# Altium project CAN_PDM.PrjPcb (part 2 of 2)

## Sheet LED_STATUS_OUTPUTS.SchDoc
size A4; SheetNumber: 12; SheetTotal: 14
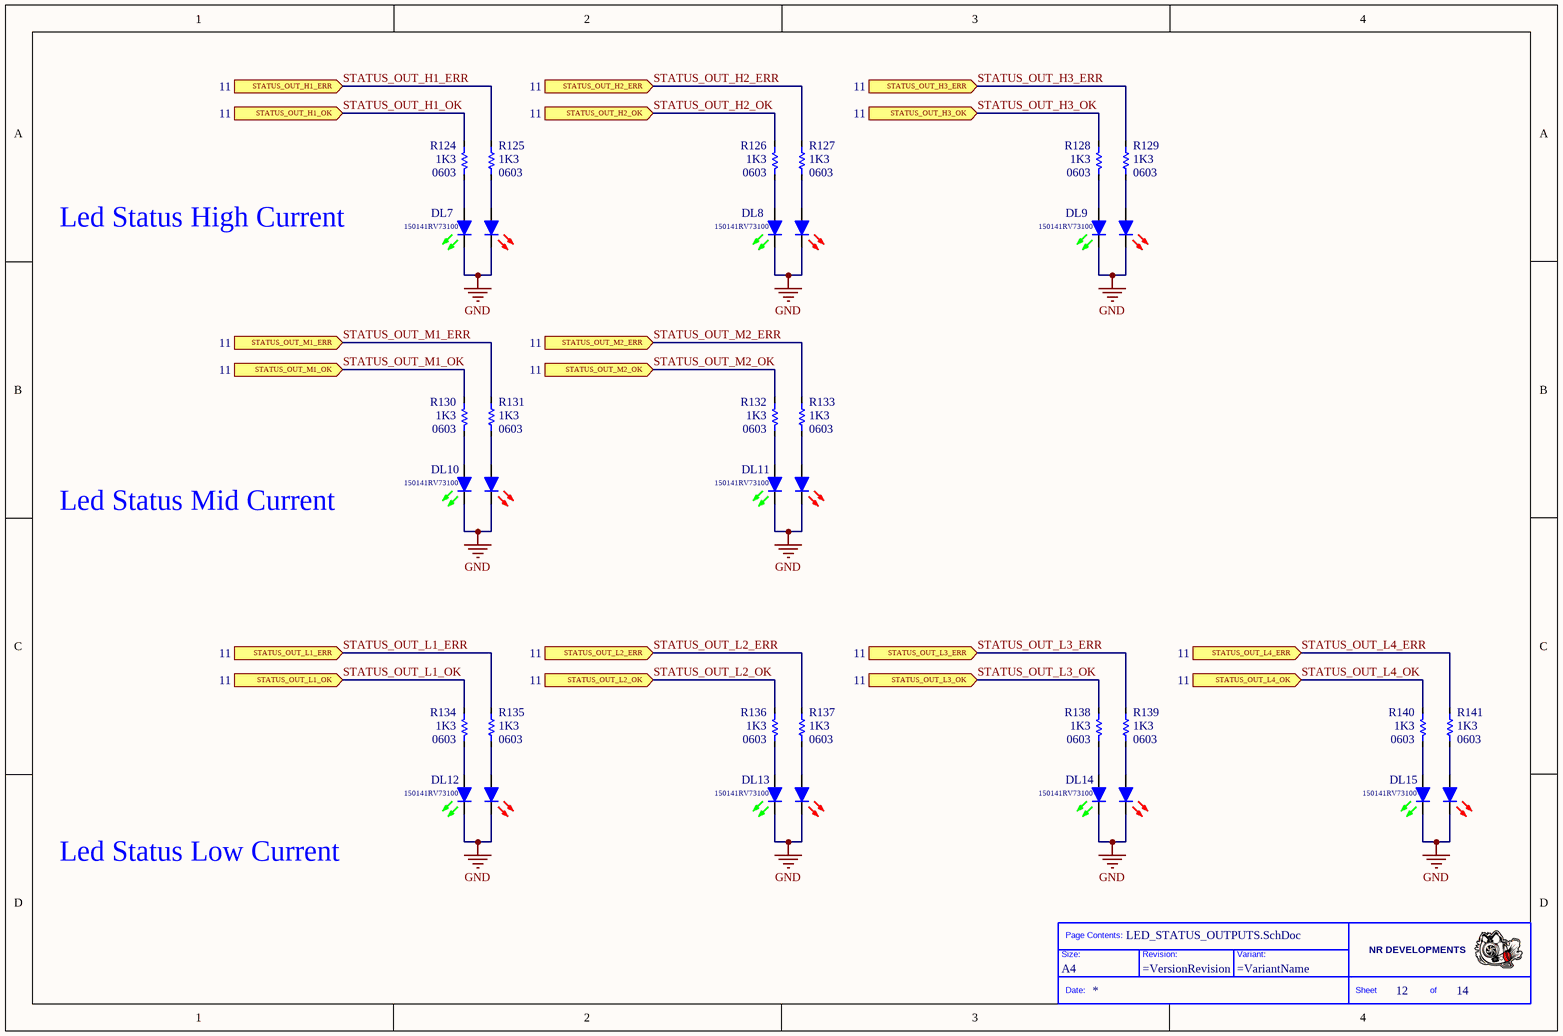
[diagram p11: LED_STATUS_OUTPUTS.SchDoc]

### Parts
(Parts that share a designator on the sheet are numbered #1, #2 ... from top to bottom, then left to right.)
*#10  Size: A4  (hidden comment: Title_Block)  (graphical)
DL7  value 150141RV73100  [WURTH-SBTW_3528]  (hidden comment: LED_Red_Green)
DL8  value 150141RV73100  [WURTH-SBTW_3528]  (hidden comment: LED_Red_Green)
DL9  value 150141RV73100  [WURTH-SBTW_3528]  (hidden comment: LED_Red_Green)
DL10  value 150141RV73100  [WURTH-SBTW_3528]  (hidden comment: LED_Red_Green)
DL11  value 150141RV73100  [WURTH-SBTW_3528]  (hidden comment: LED_Red_Green)
DL12  value 150141RV73100  [WURTH-SBTW_3528]  (hidden comment: LED_Red_Green)
DL13  value 150141RV73100  [WURTH-SBTW_3528]  (hidden comment: LED_Red_Green)
DL14  value 150141RV73100  [WURTH-SBTW_3528]  (hidden comment: LED_Red_Green)
DL15  value 150141RV73100  [WURTH-SBTW_3528]  (hidden comment: LED_Red_Green)
R124  value 1K3  Case: 0603  [RESC1608X06M]  (hidden comment: Res)
R125  value 1K3  Case: 0603  [RESC1608X06M]  (hidden comment: Res)
R126  value 1K3  Case: 0603  [RESC1608X06M]  (hidden comment: Res)
R127  value 1K3  Case: 0603  [RESC1608X06M]  (hidden comment: Res)
R128  value 1K3  Case: 0603  [RESC1608X06M]  (hidden comment: Res)
R129  value 1K3  Case: 0603  [RESC1608X06M]  (hidden comment: Res)
R130  value 1K3  Case: 0603  [RESC1608X06M]  (hidden comment: Res)
R131  value 1K3  Case: 0603  [RESC1608X06M]  (hidden comment: Res)
R132  value 1K3  Case: 0603  [RESC1608X06M]  (hidden comment: Res)
R133  value 1K3  Case: 0603  [RESC1608X06M]  (hidden comment: Res)
R134  value 1K3  Case: 0603  [RESC1608X06M]  (hidden comment: Res)
R135  value 1K3  Case: 0603  [RESC1608X06M]  (hidden comment: Res)
R136  value 1K3  Case: 0603  [RESC1608X06M]  (hidden comment: Res)
R137  value 1K3  Case: 0603  [RESC1608X06M]  (hidden comment: Res)
R138  value 1K3  Case: 0603  [RESC1608X06M]  (hidden comment: Res)
R139  value 1K3  Case: 0603  [RESC1608X06M]  (hidden comment: Res)
R140  value 1K3  Case: 0603  [RESC1608X06M]  (hidden comment: Res)
R141  value 1K3  Case: 0603  [RESC1608X06M]  (hidden comment: Res)

### Ports
STATUS_OUT_H1_ERR (in, see 11), STATUS_OUT_H1_OK (in, see 11), STATUS_OUT_H2_ERR (in, see 11), STATUS_OUT_H2_OK (in, see 11), STATUS_OUT_H3_ERR (in, see 11), STATUS_OUT_H3_OK (in, see 11), STATUS_OUT_L1_ERR (in, see 11), STATUS_OUT_L1_OK (in, see 11), STATUS_OUT_L2_ERR (in, see 11), STATUS_OUT_L2_OK (in, see 11), STATUS_OUT_L3_ERR (in, see 11), STATUS_OUT_L3_OK (in, see 11), STATUS_OUT_L4_ERR (in, see 11), STATUS_OUT_L4_OK (in, see 11), STATUS_OUT_M1_ERR (in, see 11), STATUS_OUT_M1_OK (in, see 11), STATUS_OUT_M2_ERR (in, see 11), STATUS_OUT_M2_OK (in, see 11)

### Nets
GND: DL7.C1 DL7.C2 DL8.C1 DL8.C2 DL9.C1 DL9.C2 DL10.C1 DL10.C2 DL11.C1 DL11.C2 DL12.C1 DL12.C2 DL13.C1 DL13.C2 DL14.C1 DL14.C2 DL15.C1 DL15.C2
STATUS_OUT_H1_ERR: R125.2 ; port STATUS_OUT_H1_ERR
STATUS_OUT_H1_OK: R124.2 ; port STATUS_OUT_H1_OK
STATUS_OUT_H2_ERR: R127.2 ; port STATUS_OUT_H2_ERR
STATUS_OUT_H2_OK: R126.2 ; port STATUS_OUT_H2_OK
STATUS_OUT_H3_ERR: R129.2 ; port STATUS_OUT_H3_ERR
STATUS_OUT_H3_OK: R128.2 ; port STATUS_OUT_H3_OK
STATUS_OUT_L1_ERR: R135.2 ; port STATUS_OUT_L1_ERR
STATUS_OUT_L1_OK: R134.2 ; port STATUS_OUT_L1_OK
STATUS_OUT_L2_ERR: R137.2 ; port STATUS_OUT_L2_ERR
STATUS_OUT_L2_OK: R136.2 ; port STATUS_OUT_L2_OK
STATUS_OUT_L3_ERR: R139.2 ; port STATUS_OUT_L3_ERR
STATUS_OUT_L3_OK: R138.2 ; port STATUS_OUT_L3_OK
STATUS_OUT_L4_ERR: R141.2 ; port STATUS_OUT_L4_ERR
STATUS_OUT_L4_OK: R140.2 ; port STATUS_OUT_L4_OK
STATUS_OUT_M1_ERR: R131.2 ; port STATUS_OUT_M1_ERR
STATUS_OUT_M1_OK: R130.2 ; port STATUS_OUT_M1_OK
STATUS_OUT_M2_ERR: R133.2 ; port STATUS_OUT_M2_ERR
STATUS_OUT_M2_OK: R132.2 ; port STATUS_OUT_M2_OK
NetDL7_A1: DL7.A1 R125.1
NetDL7_A2: DL7.A2 R124.1
NetDL8_A1: DL8.A1 R127.1
NetDL8_A2: DL8.A2 R126.1
NetDL9_A1: DL9.A1 R129.1
NetDL9_A2: DL9.A2 R128.1
NetDL10_A1: DL10.A1 R131.1
NetDL10_A2: DL10.A2 R130.1
NetDL11_A1: DL11.A1 R133.1
NetDL11_A2: DL11.A2 R132.1
NetDL12_A1: DL12.A1 R135.1
NetDL12_A2: DL12.A2 R134.1
NetDL13_A1: DL13.A1 R137.1
NetDL13_A2: DL13.A2 R136.1
NetDL14_A1: DL14.A1 R139.1
NetDL14_A2: DL14.A2 R138.1
NetDL15_A1: DL15.A1 R141.1
NetDL15_A2: DL15.A2 R140.1

### Notes on the sheet
- Led Status High Current
- Led Status Mid Current
- Led Status Low Current
- (in symbol Title_Block) Page Contents:; NR DEVELOPMENTS; Size:; Revision:; Variant:; Date:; Sheet; of

### Library data of the parts
DL7-DL15 = LED_Red_Green: Led Red - Green 3528; Manufacturer: Wurth; PartNumber: 150141RV73100; Case: 3528
R124-R141 = Resistor: Manufacturer: Vishay; PartNumber: RC0603FR-071K3L

## Sheet LED_STATUS_INPUT.SchDoc
size A4; SheetNumber: 13; SheetTotal: 14
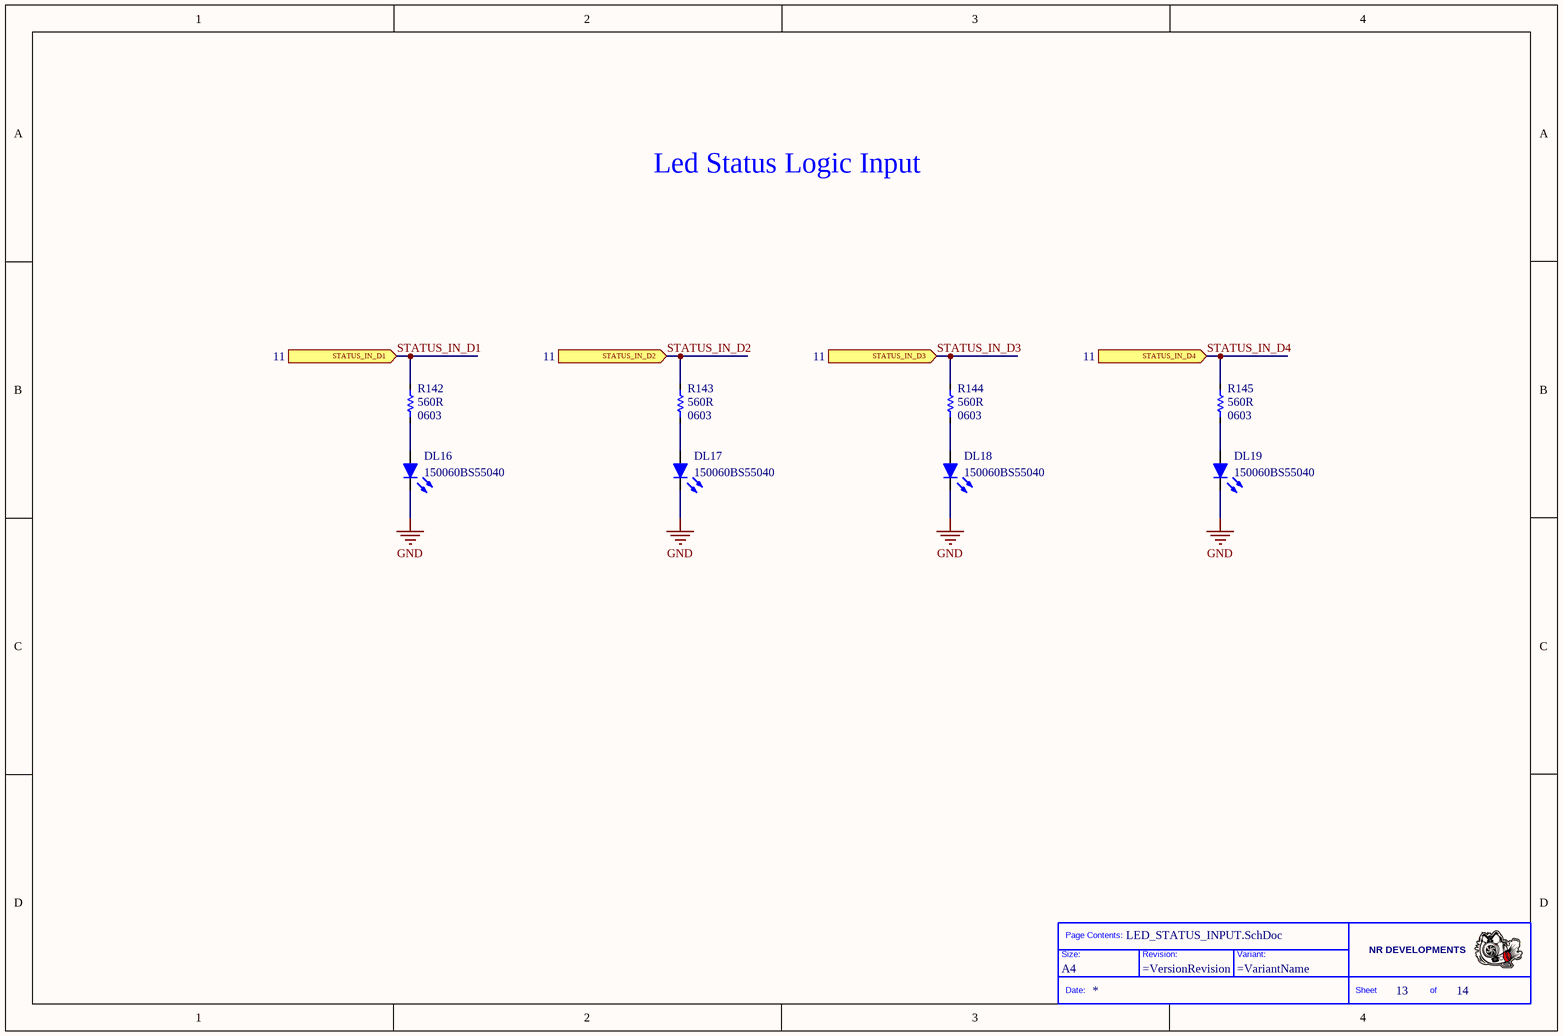
[diagram p12: LED_STATUS_INPUT.SchDoc]

### Parts
(Parts that share a designator on the sheet are numbered #1, #2 ... from top to bottom, then left to right.)
*#11  Size: A4  (hidden comment: Title_Block)  (graphical)
DL16  value 150060BS55040  [LED0603]  (hidden comment: Led_Green)
DL17  value 150060BS55040  [LED0603]  (hidden comment: Led_Green)
DL18  value 150060BS55040  [LED0603]  (hidden comment: Led_Green)
DL19  value 150060BS55040  [LED0603]  (hidden comment: Led_Green)
R142  value 560R  Case: 0603  [RESC1608X06M]  (hidden comment: Res)
R143  value 560R  Case: 0603  [RESC1608X06M]  (hidden comment: Res)
R144  value 560R  Case: 0603  [RESC1608X06M]  (hidden comment: Res)
R145  value 560R  Case: 0603  [RESC1608X06M]  (hidden comment: Res)

### Ports
STATUS_IN_D1 (in, see 11), STATUS_IN_D2 (in, see 11), STATUS_IN_D3 (in, see 11), STATUS_IN_D4 (in, see 11)

### Nets
GND: DL16.C DL17.C DL18.C DL19.C
STATUS_IN_D1: R142.2 ; port STATUS_IN_D1
STATUS_IN_D2: R143.2 ; port STATUS_IN_D2
STATUS_IN_D3: R144.2 ; port STATUS_IN_D3
STATUS_IN_D4: R145.2 ; port STATUS_IN_D4
NetDL16_A: DL16.A R142.1
NetDL17_A: DL17.A R143.1
NetDL18_A: DL18.A R144.1
NetDL19_A: DL19.A R145.1

### Notes on the sheet
- Led Status Logic Input
- (in symbol Title_Block) Page Contents:; NR DEVELOPMENTS; Size:; Revision:; Variant:; Date:; Sheet; of

### Library data of the parts
DL16-DL19 = LED_Blue: Manufacturer: Wurth Elektronik; Case: 0603; PartNumber: 150060BS55040
R142-R145 = Resistor: Manufacturer: Vishay; PartNumber: RC0603FR-07560RL

## Sheet CONNECTOR.SchDoc
size A4; SheetNumber: 14; SheetTotal: 14
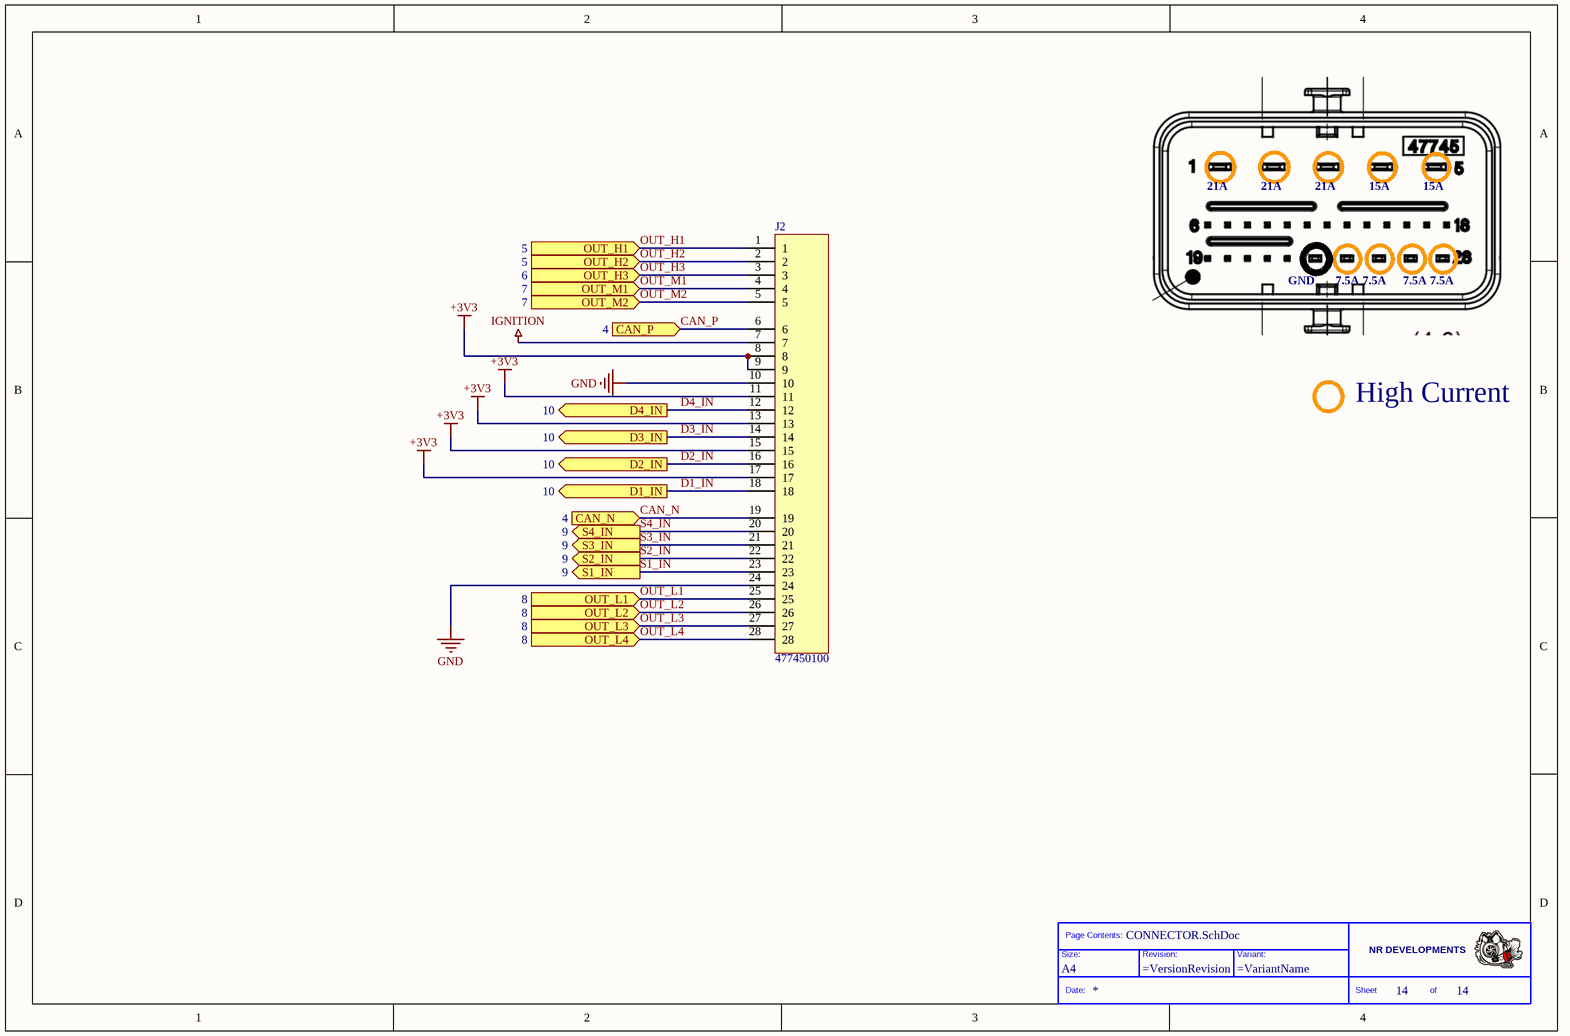
[diagram p13: CONNECTOR.SchDoc]

### Parts
(Parts that share a designator on the sheet are numbered #1, #2 ... from top to bottom, then left to right.)
*#12  Size: A4  (hidden comment: Title_Block)  (graphical)
J2  value 477450100  [MOLEX_0477450100]  (hidden comment: Connector)

### Ports
CAN_N (in, see 4), CAN_P (in, see 4), D1_IN (out, see 10), D2_IN (out, see 10), D3_IN (out, see 10), D4_IN (out, see 10), OUT_H1 (in, see 5), OUT_H2 (in, see 5), OUT_H3 (in, see 6), OUT_L1 (in, see 8), OUT_L2 (in, see 8), OUT_L3 (in, see 8), OUT_L4 (in, see 8), OUT_M1 (in, see 7), OUT_M2 (in, see 7), S1_IN (out, see 9), S2_IN (out, see 9), S3_IN (out, see 9), S4_IN (out, see 9)

### Nets
+3V3: J2.8 J2.9 J2.11 J2.13 J2.15 J2.17
GND: J2.10 J2.24
IGNITION: J2.7
CAN_N: J2.19 ; port CAN_N
CAN_P: J2.6 ; port CAN_P
D1_IN: J2.18 ; port D1_IN
D2_IN: J2.16 ; port D2_IN
D3_IN: J2.14 ; port D3_IN
D4_IN: J2.12 ; port D4_IN
OUT_H1: J2.1 ; port OUT_H1
OUT_H2: J2.2 ; port OUT_H2
OUT_H3: J2.3 ; port OUT_H3
OUT_L1: J2.25 ; port OUT_L1
OUT_L2: J2.26 ; port OUT_L2
OUT_L3: J2.27 ; port OUT_L3
OUT_L4: J2.28 ; port OUT_L4
OUT_M1: J2.4 ; port OUT_M1
OUT_M2: J2.5 ; port OUT_M2
S1_IN: J2.23 ; port S1_IN
S2_IN: J2.22 ; port S2_IN
S3_IN: J2.21 ; port S3_IN
S4_IN: J2.20 ; port S4_IN

### Notes on the sheet
- 21A
- 15A
- GND
- 7.5A
- High Current
- (in symbol Title_Block) Page Contents:; NR DEVELOPMENTS; Size:; Revision:; Variant:; Date:; Sheet; of

### Library data of the parts
J2 = MOLEX_477450100: Connector Header Board Edge, Through Hole, Right Angle 28 position; Manufacturer: Molex; PartNumber: 0477450100

## Nets that join several sheets
5V: PWR (10 pins), USB (J3.A4-B9 J3.B4-A9 R148.2), CAN (C25.1 C26.1 C28.1 U4.3), SENSOR_INP (12 pins), I2C (C59.1 U14.27)
+3V3: PWR (C8.1 R6.2 TP7.1 U2.5), MCU (18 pins), CAN (C27.1 C28.2 R14.2 U4.5), HIGH_CURR_MOS (R21.2 R27.2), HIGH_CURR_MOS2 (R154.2), MID_CURR_MOS (R35.2 R41.2), LOW_CURR_MOS (R106.2 R117.2), SENSOR_INP (R49.2 R51.2 R65.2 R67.2), DIGITAL_INP (R78.2 R79.2 R86.2 R87.2), I2C (11 pins), CONNECTOR (6 pins)
+12V: PWR (D1.A D3.2 MP1.1 MP2.1), MCU (R10.2), HIGH_CURR_MOS (6 pins), HIGH_CURR_MOS2 (C71.1 C72.1 U18.15), MID_CURR_MOS (6 pins), LOW_CURR_MOS (6 pins)
GND: PWR (15 pins), MCU (30 pins), USB (10 pins), CAN (9 pins), HIGH_CURR_MOS (14 pins), HIGH_CURR_MOS2 (7 pins), MID_CURR_MOS (14 pins), LOW_CURR_MOS (20 pins), SENSOR_INP (20 pins), DIGITAL_INP (9 pins), I2C (17 pins), LED_STATUS_OUTPUTS (18 pins), LED_STATUS_INPUT (DL16.C DL17.C DL18.C DL19.C), CONNECTOR (J2.10 J2.24)
IGNITION: PWR (R3.1 R7.2), CONNECTOR (J2.7)
CAN_N: CAN (D5.1 L4.2), CONNECTOR (J2.19)
CAN_P: CAN (D5.2 L3.2), CONNECTOR (J2.6)
D1_IN: DIGITAL_INP (D10.1 R80.1), CONNECTOR (J2.18)
D2_IN: DIGITAL_INP (D10.3 R88.1), CONNECTOR (J2.16)
D3_IN: DIGITAL_INP (D10.5 R82.1), CONNECTOR (J2.14)
D4_IN: DIGITAL_INP (D10.4 R90.1), CONNECTOR (J2.12)
I2C_SCL: MCU (U3.58), I2C (5 pins)
I2C_SDA: MCU (U3.59), I2C (5 pins)
MCU_CAN_RX: MCU (U3.61), CAN (U4.4)
MCU_CAN_TX: MCU (U3.62), CAN (R14.1 U4.1)
MCU_DIG1: MCU (U3.50), DIGITAL_INP (R78.1 R81.2 R84.2)
MCU_DIG2: MCU (U3.51), DIGITAL_INP (R86.1 R89.2 R92.2)
MCU_DIG3: MCU (U3.52), DIGITAL_INP (R79.1 R83.2 R85.2)
MCU_DIG4: MCU (U3.53), DIGITAL_INP (R87.1 R91.2 R93.2)
MCU_DSEL_L1_2: MCU (U3.27), LOW_CURR_MOS (R104.2 R107.1)
MCU_DSEL_L3_4: MCU (U3.41), LOW_CURR_MOS (R115.2 R118.1)
MCU_IN_H1: MCU (U3.35), HIGH_CURR_MOS (R19.2 R22.1)
MCU_IN_H2: MCU (U3.36), HIGH_CURR_MOS (R18.2 R28.1)
MCU_IN_H3: MCU (U3.37), HIGH_CURR_MOS2 (R152.2 R155.1)
MCU_IN_L1: MCU (U3.28), LOW_CURR_MOS (R103.2 R108.1)
MCU_IN_L2: MCU (U3.26), LOW_CURR_MOS (R102.2 R109.1)
MCU_IN_L3: MCU (U3.29), LOW_CURR_MOS (R114.2 R119.1)
MCU_IN_L4: MCU (U3.40), LOW_CURR_MOS (R113.2 R120.1)
MCU_IN_M1: MCU (U3.38), MID_CURR_MOS (R33.2 R36.1)
MCU_IN_M2: MCU (U3.39), MID_CURR_MOS (R32.2 R42.1)
MCU_IS_H1: MCU (U3.23), HIGH_CURR_MOS (C32.1 R23.1)
MCU_IS_H2: MCU (U3.22), HIGH_CURR_MOS (C36.1 R29.1)
MCU_IS_H3: MCU (U3.21), HIGH_CURR_MOS2 (C74.1 R156.1)
MCU_IS_L1_2: MCU (U3.14), LOW_CURR_MOS (C65.1 R110.1)
MCU_IS_L3_4: MCU (U3.15), LOW_CURR_MOS (C70.1 R121.1)
MCU_IS_M1: MCU (U3.20), MID_CURR_MOS (C40.1 R37.1)
MCU_IS_M2: MCU (U3.16), MID_CURR_MOS (C44.1 R43.1)
MCU_SENS1: MCU (U3.8), SENSOR_INP (C45.1 R49.1 R54.2 R60.2)
MCU_SENS2: MCU (U3.9), SENSOR_INP (C49.1 R65.1 R70.2 R76.2)
MCU_SENS3: MCU (U3.10), SENSOR_INP (C46.1 R51.1 R55.2 R61.2)
MCU_SENS4: MCU (U3.11), SENSOR_INP (C50.1 R67.1 R71.2 R77.2)
MCU_USB_VBUS: MCU (U3.42), USB (R148.1 R149.2)
MCU_USBD_N: MCU (U3.44), USB (D13.2 R147.1)
MCU_USBD_P: MCU (U3.45), USB (D13.1 R146.1)
OUT_H1: HIGH_CURR_MOS (8 pins), CONNECTOR (J2.1)
OUT_H2: HIGH_CURR_MOS (8 pins), CONNECTOR (J2.2)
OUT_H3: HIGH_CURR_MOS2 (8 pins), CONNECTOR (J2.3)
OUT_L1: LOW_CURR_MOS (C63.1 U16.12 U16.13 U16.14), CONNECTOR (J2.25)
OUT_L2: LOW_CURR_MOS (C64.1 U16.8 U16.9 U16.10), CONNECTOR (J2.26)
OUT_L3: LOW_CURR_MOS (C68.1 U17.12 U17.13 U17.14), CONNECTOR (J2.27)
OUT_L4: LOW_CURR_MOS (C69.1 U17.8 U17.9 U17.10), CONNECTOR (J2.28)
OUT_M1: MID_CURR_MOS (8 pins), CONNECTOR (J2.4)
OUT_M2: MID_CURR_MOS (8 pins), CONNECTOR (J2.5)
S1_IN: SENSOR_INP (R48.1 R56.1 R60.1), CONNECTOR (J2.23)
S2_IN: SENSOR_INP (R64.1 R72.1 R76.1), CONNECTOR (J2.22)
S3_IN: SENSOR_INP (R50.1 R57.1 R61.1), CONNECTOR (J2.21)
S4_IN: SENSOR_INP (R66.1 R73.1 R77.1), CONNECTOR (J2.20)
STATUS_CAN_RX: MCU (U3.34), CAN (R16.2)
STATUS_CAN_TX: MCU (U3.33), CAN (R17.2)
STATUS_IN_D1: I2C (U14.4), LED_STATUS_INPUT (R142.2)
STATUS_IN_D2: I2C (U14.3), LED_STATUS_INPUT (R143.2)
STATUS_IN_D3: I2C (U14.2), LED_STATUS_INPUT (R144.2)
STATUS_IN_D4: I2C (U14.1), LED_STATUS_INPUT (R145.2)
STATUS_OUT_H1_ERR: I2C (U14.21), LED_STATUS_OUTPUTS (R125.2)
STATUS_OUT_H1_OK: I2C (U14.22), LED_STATUS_OUTPUTS (R124.2)
STATUS_OUT_H2_ERR: I2C (U14.19), LED_STATUS_OUTPUTS (R127.2)
STATUS_OUT_H2_OK: I2C (U14.20), LED_STATUS_OUTPUTS (R126.2)
STATUS_OUT_H3_ERR: I2C (U14.17), LED_STATUS_OUTPUTS (R129.2)
STATUS_OUT_H3_OK: I2C (U14.18), LED_STATUS_OUTPUTS (R128.2)
STATUS_OUT_L1_ERR: I2C (U14.11), LED_STATUS_OUTPUTS (R135.2)
STATUS_OUT_L1_OK: I2C (U14.12), LED_STATUS_OUTPUTS (R134.2)
STATUS_OUT_L2_ERR: I2C (U14.9), LED_STATUS_OUTPUTS (R137.2)
STATUS_OUT_L2_OK: I2C (U14.10), LED_STATUS_OUTPUTS (R136.2)
STATUS_OUT_L3_ERR: I2C (U14.7), LED_STATUS_OUTPUTS (R139.2)
STATUS_OUT_L3_OK: I2C (U14.8), LED_STATUS_OUTPUTS (R138.2)
STATUS_OUT_L4_ERR: I2C (U14.5), LED_STATUS_OUTPUTS (R141.2)
STATUS_OUT_L4_OK: I2C (U14.6), LED_STATUS_OUTPUTS (R140.2)
STATUS_OUT_M1_ERR: I2C (U14.15), LED_STATUS_OUTPUTS (R131.2)
STATUS_OUT_M1_OK: I2C (U14.16), LED_STATUS_OUTPUTS (R130.2)
STATUS_OUT_M2_ERR: I2C (U14.13), LED_STATUS_OUTPUTS (R133.2)
STATUS_OUT_M2_OK: I2C (U14.14), LED_STATUS_OUTPUTS (R132.2)

## Assembly variants
V1: not fitted C45 C46 C49 C50 D2 R48 R49 R50 R51 R60 R61 R64 R65 R66 R67 R76 R77 R84 R85 R92 R93